# Altium schematic sheet KeyPadScanner.SchDoc
size B; Organization: Altium Limited; Address1: L3, 12a Rodborough Rd; Address2: Frenchs Forest; Address3: NSW; Address4: Australia 2086; DocumentNumber: 3; SheetNumber: 3; SheetTotal: 6
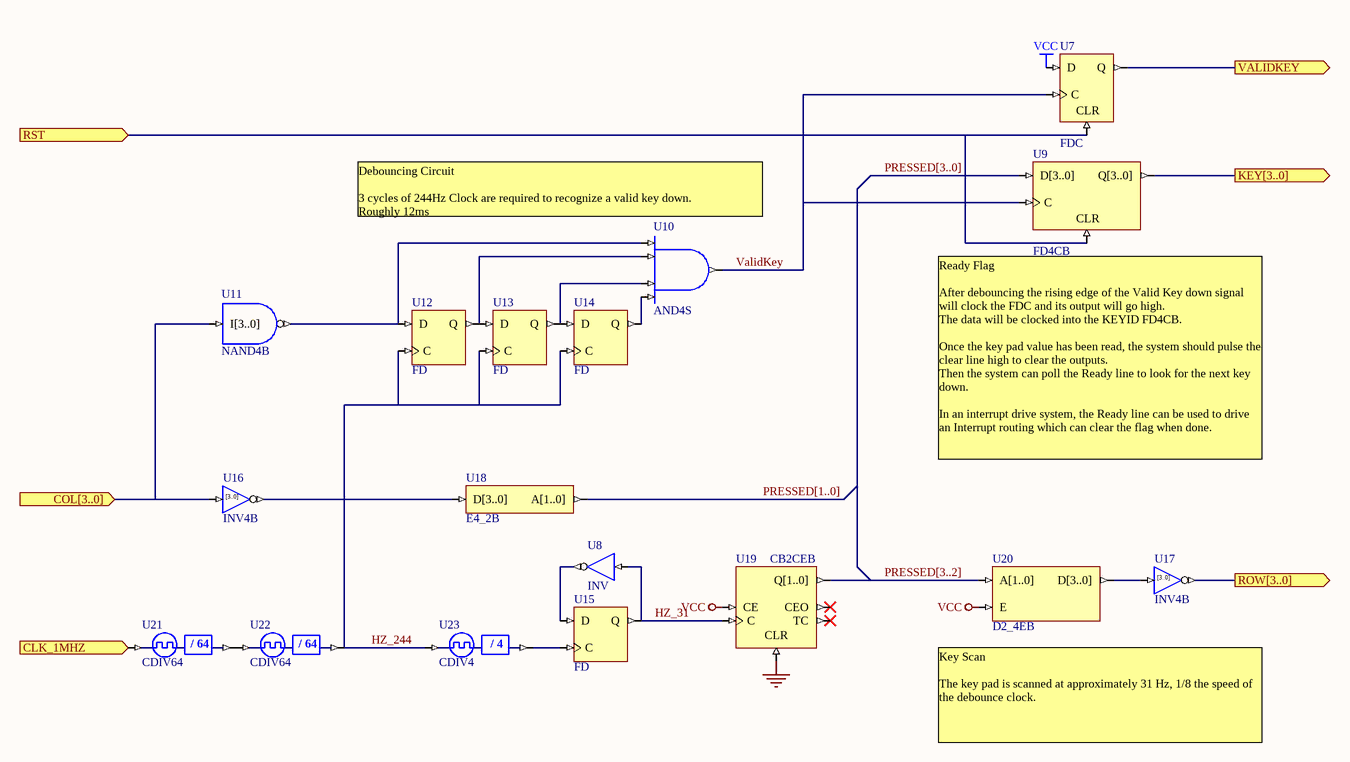
[diagram p0: KeyPadScanner.SchDoc]

## Parts
U7  FDC
U8  INV
U9  FD4CB
U10  AND4S
U11  NAND4B
U12  FD
U13  FD
U14  FD
U15  FD
U16  INV4B
U17  INV4B
U18  E4_2B
U19  CB2CEB
U20  D2_4EB
U21  CDIV64
U22  CDIV64
U23  CDIV4

## Ports
CLK_1MHZ (in), COL[3..0] (in), KEY[3..0] (out), ROW[3..0] (out), RST (in), VALIDKEY (out)

## Nets
GND: U19.CLR
VCC: U7.D U19.CE U20.E
CLK_1MHZ: U21.CLKIN ; port CLK_1MHZ
COL[3..0]: U11.I[3..0] U16.I[3..0] ; port COL[3..0]
HZ_31: U8.I U15.Q U19.C
HZ_244: U12.C U13.C U14.C U22.CLKDV U23.CLKIN
KEY[3..0]: U9.Q[3..0] ; port KEY[3..0]
PRESSED[1..0]: U18.A[1..0]
PRESSED[3..0]: U9.D[3..0]
PRESSED[3..2]: U19.Q[1..0] U20.A[1..0]
ROW[3..0]: U17.O[3..0] ; port ROW[3..0]
RST: U7.CLR U9.CLR ; port RST
ValidKey: U7.C U9.C U10.O
VALIDKEY: U7.Q ; port VALIDKEY  [a separate net that carries the same name]
NetU8_O: U8.O U15.D
NetU10_I0: U10.I0 U11.O U12.D
NetU10_I1: U10.I1 U12.Q U13.D
NetU10_I2: U10.I2 U13.Q U14.D
NetU10_I3: U10.I3 U14.Q
NetU15_C: U15.C U23.CLKDV
NetU16_O[3..0]: U16.O[3..0] U18.D[3..0]
NetU17_I[3..0]: U17.I[3..0] U20.D[3..0]
NetU21_CLKDV: U21.CLKDV U22.CLKIN

Not connected (* = marked no-connect by the designer): U19 CEO* TC*

## Buses and harness runs
bus PRESSED[1..0]
bus PRESSED[3..0]
bus PRESSED[3..2]

## Notes on the sheet
- (near U10) Debouncing Circuit
  3 cycles of 244Hz Clock are required to recognize a valid key down.
  Roughly 12ms
- (near U9) Ready Flag
  After debouncing the rising edge of the Valid Key down signal will clock the FDC and its output will go high.
  The data will be clocked into the KEYID FD4CB.
  Once the key pad value has been read, the system should pulse the clear line high to clear the outputs.
  Then the system can poll the Ready line to look for the next key down.
  In an interrupt drive system, the Ready line can be used to drive an Interrupt routing which can clear the flag when done.
- (near U20) Key Scan
  The key pad is scanned at approximately 31 Hz, 1/8 the speed of the debounce clock.
- Title
- Size:
- Date:
- B
- Number:
- Time:
- Revision:
- Sheet
- of
- File:
- (in symbol CDIV4) / 4
- (in symbol CDIV64) / 64
- (in symbol INV4B) [3..0]

## Library data of the parts
U7 = FDC: D-Type Flip-Flop with Asynchronous Clear; ArchiveName: GENERIC; Published: 18-Dec-2003; Publisher: Altium Limited; Xilinx Equivalent: FDC; Core Revision: 1.00.00
U8 = INV: Inverter; ArchiveName: GENERIC; Published: 18-Nov-2003; Publisher: Altium Limited; Xilinx Equivalent: INV; Core Revision: 1.00.00
U9 = FD4CB: 4-Bit D-Type Flip-Flop with Asynchronous Clear, Bus Version; ArchiveName: GENERIC; Published: 18-Dec-2003; Publisher: Altium Limited; Core Revision: 1.00.00
U10 = AND4S: 4-Input AND Gate, Single Pin Version; Xilinx Equivalent: AND4; ArchiveName: GENERIC; Published: 18-Nov-2003; Publisher: Altium Limited; Core Revision: 1.00.00
U11 = NAND4B: 4-Input NAND Gate, Bus Version; ArchiveName: GENERIC; Published: 18-Nov-2003; Publisher: Altium Limited; Core Revision: 1.00.00
U12-U15 = FD: D-Type Flip-Flop; ArchiveName: GENERIC; Published: 18-Nov-2003; Publisher: Altium Limited; Xilinx Equivalent: FD; Core Revision: 1.00.00
U16 U17 = INV4B: 4-Bit Inverter, Bus Version; ArchiveName: GENERIC; Published: 18-Nov-2003; Publisher: Altium Limited; Core Revision: 1.00.00
U18 = E4_2B: 4- to 2-Bit Priority Encoder, Bus Version; ArchiveName: GENERIC; Published: 18-Nov-2003; Publisher: Altium Limited; Core Revision: 1.00.00
U19 = CB2CEB: 2-Bit Cascadable Binary Counters with Clock Enable and Asynchronous Clear, Bus Version; ArchiveName: GENERIC; Published: 18-Dec-2003; Publisher: Altium Limited; Core Revision: 1.00.00
U20 = D2_4EB: Binary 2- to 4-Bit Decoder with Enable, Bus Version; ArchiveName: GENERIC; Published: 18-Nov-2003; Publisher: Altium Limited; Core Revision: 1.00.00
U21 U22 = CDIV64: Clock Divider by 64; ArchiveName: GENERIC; Published: 18-Nov-2003; Publisher: Altium Limited; Core Revision: 1.00.00
U23 = CDIV4: Clock Divider by 4; ArchiveName: GENERIC; Published: 18-Nov-2003; Publisher: Altium Limited; Core Revision: 1.00.00